# Altium project UCLA-DRS4.PrjPCB (part 1 of 10)
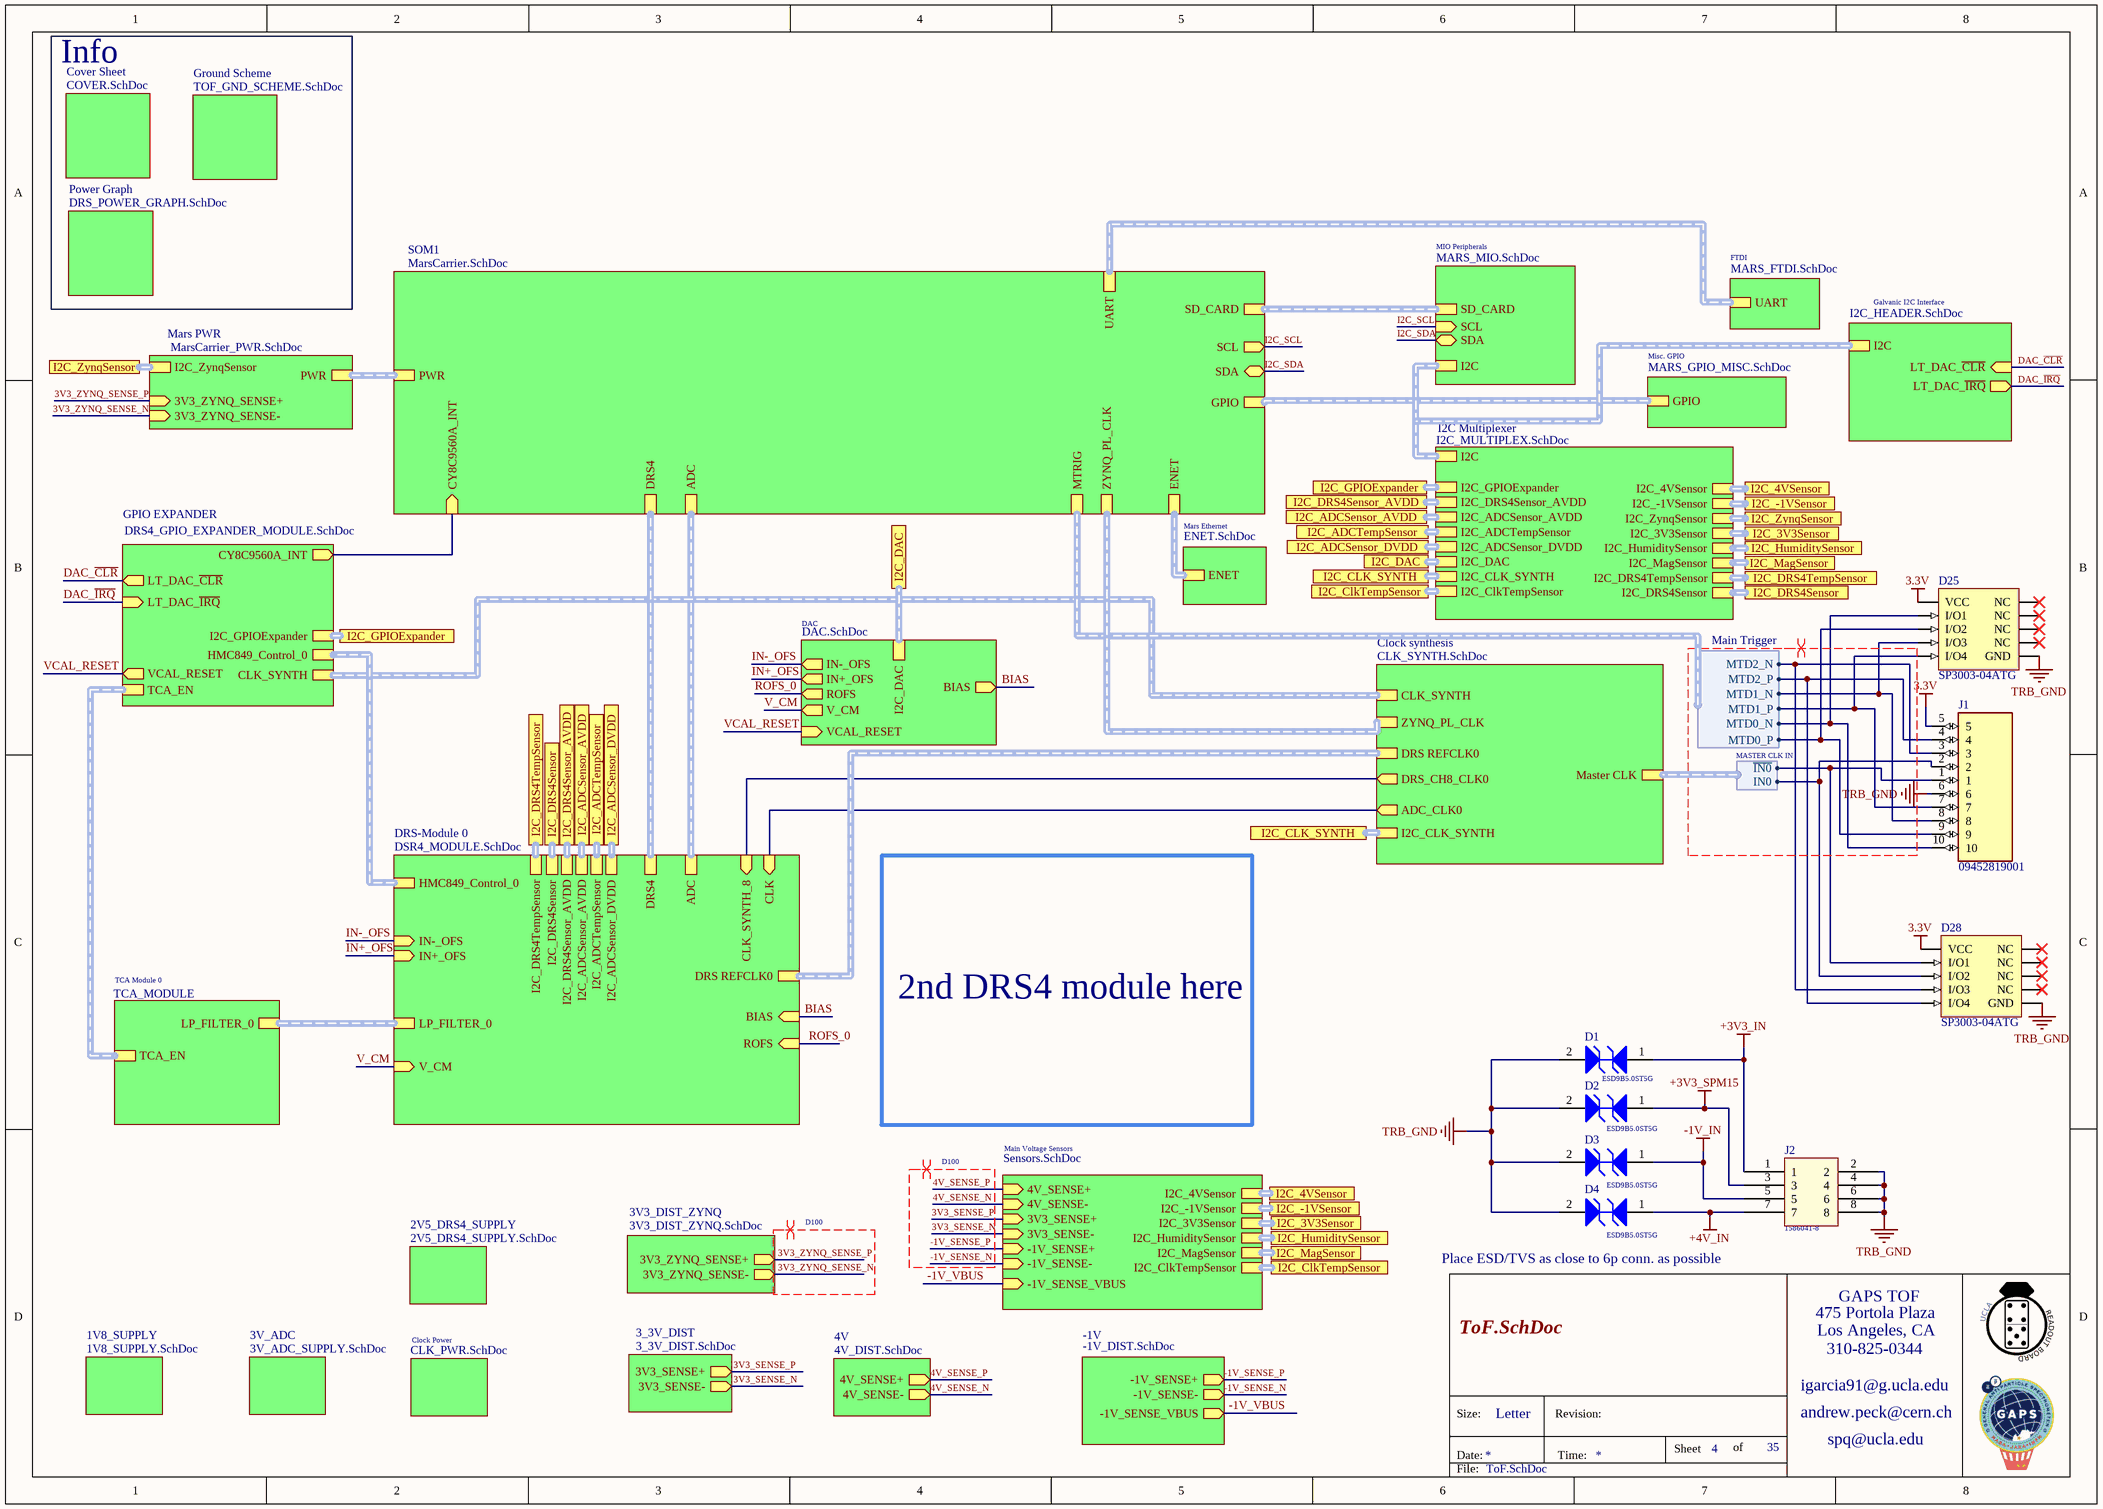
[diagram p0: ToF.SchDoc]
Revision: V2.3.9
35 sheets, 1264 parts. Net scope: hierarchical (ports join the sheet entries above them; power ports are global).
Board file: DRS4-PCB.PcbDoc
Sheets:
  ToF.SchDoc
    DRS-Module 0 = DSR4_MODULE.SchDoc
      DRS1 = DRS4.SchDoc
      FE0 = ANA_FE.SchDoc
      ADC = DRS4_ADC.SchDoc
      FE2 = ANA_FE.SchDoc
      FE4 = ANA_FE.SchDoc
      FE6 = ANA_FE.SchDoc
      FE1 = ANA_FE.SchDoc
      FE3 = ANA_FE.SchDoc
      FE5 = ANA_FE.SchDoc
      FE7 = ANA_FE.SchDoc
      FE8 = ANA_FE_CLK_SYNTH.SchDoc
    SOM1 = MarsCarrier.SchDoc
    Mars Ethernet = ENET.SchDoc
    DAC = DAC.SchDoc
    Clock synthesis = CLK_SYNTH.SchDoc
    TCA Module 0 = TCA_MODULE.SchDoc
      TCA CLK = TCA_CLK_DIST.SchDoc
      TCA FILTER = TCA_LP_FILTER.SchDoc
    MIO Peripherals = MARS_MIO.SchDoc
    Clock Power = CLK_PWR.SchDoc
    2V5_DRS4_SUPPLY = 2V5_DRS4_SUPPLY.SchDoc
    4V = 4V_DIST.SchDoc
    -1V = -1V_DIST.SchDoc
    3V_ADC = 3V_ADC_SUPPLY.SchDoc
    Mars PWR = MarsCarrier_PWR.SchDoc
      MarsZX2 PWR Reset = MARS_PORB.SchDoc
    3V3_DIST_ZYNQ = 3V3_DIST_ZYNQ.SchDoc
    3_3V_DIST = 3_3V_DIST.SchDoc
    Main Voltage Sensors = Sensors.SchDoc
    Misc. GPIO = MARS_GPIO_MISC.SchDoc
    FTDI = MARS_FTDI.SchDoc
    GPIO EXPANDER = DRS4_GPIO_EXPANDER_MODULE.SchDoc
      I2C GPIO = DRS4_GPIO_EXPANDER.SchDoc
      I2C GPIO LED = GPIO_EXPANDER_LED.SchDoc
    Galvanic I2C Interface = I2C_HEADER.SchDoc
    I2C Multiplexer = I2C_MULTIPLEX.SchDoc
    1V8_SUPPLY = 1V8_SUPPLY.SchDoc
    Cover Sheet = COVER.SchDoc
    Ground Scheme = TOF_GND_SCHEME.SchDoc
    Power Graph = DRS_POWER_GRAPH.SchDoc

## Sheet ToF.SchDoc: My title
size A3; Organization: University of California; Address1: 475 Portola Plaza; Address2: Los Angeles, CA 90095; DocumentNumber: 4; Revision: R01; SheetNumber: 4; SheetTotal: 35

### Parts
D1  ESD9B5.0ST5G  [ONSC-SOD-923-2-514AB-01_V]
D2  ESD9B5.0ST5G  [ONSC-SOD-923-2-514AB-01_V]
D3  ESD9B5.0ST5G  [ONSC-SOD-923-2-514AB-01_V]
D4  ESD9B5.0ST5G  [ONSC-SOD-923-2-514AB-01_V]
D25  Series: SP3003-04ATG  [Diode_SP3003-04ATG_LVDS_ESD]  (hidden comment: Diode_SP3003-04ATG_LVDS_ESD)
D28  Series: SP3003-04ATG  [Diode_SP3003-04ATG_LVDS_ESD]  (hidden comment: Diode_SP3003-04ATG_LVDS_ESD)
J1  09452819001  [09452812561]
J2  Series: 1586041-8  [Header_TE_Connectivity_1586041-8_8POS]  (hidden comment: Header_TE_Connectivity_1586041-8_8POS)

### Sub-sheets
1V8_SUPPLY = 1V8_SUPPLY.SchDoc: no entries
2V5_DRS4_SUPPLY = 2V5_DRS4_SUPPLY.SchDoc: no entries
3_3V_DIST = 3_3V_DIST.SchDoc: 3V3_SENSE- (out), 3V3_SENSE+ (out)
3V3_DIST_ZYNQ = 3V3_DIST_ZYNQ.SchDoc: 3V3_ZYNQ_SENSE- (out), 3V3_ZYNQ_SENSE+ (out)
3V_ADC = 3V_ADC_SUPPLY.SchDoc: no entries
4V = 4V_DIST.SchDoc: 4V_SENSE- (out), 4V_SENSE+ (out)
-1V = -1V_DIST.SchDoc: -1V_SENSE- (out), -1V_SENSE+ (out), -1V_SENSE_VBUS (out)
Clock Power = CLK_PWR.SchDoc: no entries
Clock synthesis = CLK_SYNTH.SchDoc: CLK_SYNTH (harness CLK SYNTH CONTROL), ZYNQ_PL_CLK (harness ZYNQ PL CLK), DRS REFCLK0 (harness DRS4 REFCLK0), DRS_CH8_CLK0 (out), Master CLK (harness MASTER CLK IN), ADC_CLK0 (out), I2C_CLK_SYNTH (harness Clock Synth I2C)
Cover Sheet = COVER.SchDoc: no entries
DAC = DAC.SchDoc: I2C_DAC (harness DAC  I2C), IN-_OFS (out), IN+_OFS (out), ROFS (out), V_CM (out), VCAL_RESET (in), BIAS (out)
DRS-Module 0 = DSR4_MODULE.SchDoc: ADC (harness ADC), DRS4 (harness DRS4), DRS REFCLK0 (harness DRS4 REFCLK0), BIAS (in), ROFS (in), HMC849_Control_0 (harness HMC849 Control 0), LP_FILTER_0 (harness TCA Filter 0), V_CM (in), CLK_SYNTH_8 (in), IN-_OFS (in), IN+_OFS (in), CLK (in), I2C_DRS4TempSensor (harness DRS4 Temp Sensor I2C), I2C_DRS4Sensor (harness DRS4 Current Sensor I2C), I2C_DRS4Sensor_AVDD (harness DRS4 AVDD Current Sensor I2C), I2C_ADCSensor_AVDD (harness ADC AVDD Current Sensor I2C), I2C_ADCTempSensor (harness ADC Temp Sensor I2C), I2C_ADCSensor_DVDD (harness ADC DVDD Current Sensor I2C)
FTDI = MARS_FTDI.SchDoc: UART (harness Mars UART)
Galvanic I2C Interface = I2C_HEADER.SchDoc: I2C (harness Mars I2C), LT_DAC_~{CLR} (in), LT_DAC_~{IRQ} (out)
GPIO EXPANDER = DRS4_GPIO_EXPANDER_MODULE.SchDoc: HMC849_Control_0 (harness HMC849 Control 0), CLK_SYNTH (harness CLK SYNTH CONTROL), TCA_EN (harness TCA EN), VCAL_RESET (out), LT_DAC_~{CLR} (out), LT_DAC_~{IRQ} (in), CY8C9560A_INT (out), I2C_GPIOExpander (harness GPIO Expander I2C)
Ground Scheme = TOF_GND_SCHEME.SchDoc: no entries
I2C Multiplexer = I2C_MULTIPLEX.SchDoc: I2C (harness Mars I2C), I2C_4VSensor (harness 4V Current Sensor I2C), I2C_-1VSensor (harness -1V Current Sensor I2C), I2C_ZynqSensor (harness 3V3 Zynq Current Sensor I2C), I2C_3V3Sensor (harness 3V3 Current Sensor I2C), I2C_HumiditySensor (harness Humidity Sensor I2C), I2C_MagSensor (harness Magnetic Field Sensor I2C), I2C_DRS4TempSensor (harness DRS4 Temp Sensor I2C), I2C_DRS4Sensor (harness DRS4 Current Sensor I2C), I2C_GPIOExpander (harness GPIO Expander I2C), I2C_DRS4Sensor_AVDD (harness DRS4 AVDD Current Sensor I2C), I2C_ADCSensor_AVDD (harness ADC AVDD Current Sensor I2C), I2C_ADCTempSensor (harness ADC Temp Sensor I2C), I2C_ADCSensor_DVDD (harness ADC DVDD Current Sensor I2C), I2C_DAC (harness DAC  I2C), I2C_CLK_SYNTH (harness Clock Synth I2C), I2C_ClkTempSensor (harness Clk Synth Temp Sensor I2C)
Main Voltage Sensors = Sensors.SchDoc: -1V_SENSE- (in), -1V_SENSE+ (in), 4V_SENSE- (in), 4V_SENSE+ (in), 3V3_SENSE- (in), 3V3_SENSE+ (in), I2C_4VSensor (harness 4V Current Sensor I2C), I2C_-1VSensor (harness -1V Current Sensor I2C), I2C_3V3Sensor (harness 3V3 Current Sensor I2C), I2C_HumiditySensor (harness Humidity Sensor I2C), I2C_MagSensor (harness Magnetic Field Sensor I2C), I2C_ClkTempSensor (harness Clk Synth Temp Sensor I2C), -1V_SENSE_VBUS (in)
Mars Ethernet = ENET.SchDoc: ENET (harness Mars ENET)
Mars PWR = MarsCarrier_PWR.SchDoc: PWR (harness Mars Power), 3V3_ZYNQ_SENSE- (in), 3V3_ZYNQ_SENSE+ (in), I2C_ZynqSensor (harness 3V3 Zynq Current Sensor I2C)
MIO Peripherals = MARS_MIO.SchDoc: SD_CARD (harness Mars SD Card), SCL (in), SDA (bidir), I2C (harness Mars I2C)
Misc. GPIO = MARS_GPIO_MISC.SchDoc: GPIO (harness Misc I/O)
Power Graph = DRS_POWER_GRAPH.SchDoc: no entries
SOM1 = MarsCarrier.SchDoc: ADC (harness ADC), DRS4 (harness DRS4), ZYNQ_PL_CLK (harness ZYNQ PL CLK), ENET (harness Mars ENET), SD_CARD (harness Mars SD Card), SCL (out), SDA (bidir), PWR (harness Mars Power), GPIO (harness Misc I/O), UART (harness Mars UART), CY8C9560A_INT (in), MTRIG (harness Main Trigger)
TCA Module 0 = TCA_MODULE: LP_FILTER_0 (harness TCA Filter 0), TCA_EN (harness TCA EN)

### Ports
I2C_3V3Sensor (harness 3V3 Current Sensor I2C), I2C_4VSensor (harness 4V Current Sensor I2C), I2C_-1VSensor (harness -1V Current Sensor I2C), I2C_ADCSensor_AVDD (harness ADC AVDD Current Sensor I2C), I2C_ADCSensor_DVDD (harness ADC DVDD Current Sensor I2C), I2C_ADCTempSensor (harness ADC Temp Sensor I2C), I2C_CLK_SYNTH (harness Clock Synth I2C), I2C_ClkTempSensor (harness Clk Synth Temp Sensor I2C), I2C_DAC (harness DAC  I2C), I2C_DRS4Sensor (harness DRS4 Current Sensor I2C), I2C_DRS4Sensor_AVDD (harness DRS4 AVDD Current Sensor I2C), I2C_DRS4TempSensor (harness DRS4 Temp Sensor I2C), I2C_GPIOExpander (harness GPIO Expander I2C), I2C_HumiditySensor (harness Humidity Sensor I2C), I2C_MagSensor (harness Magnetic Field Sensor I2C), I2C_ZynqSensor (harness 3V3 Zynq Current Sensor I2C)

### Harnesses
MASTER CLK IN: IN0, ~{IN0}
Main Trigger: MTD0_P, MTD0_N, MTD1_P, MTD1_N, MTD2_P, MTD2_N

### Nets
3.3V: D25.3(VCC) D28.3(VCC) J1.5
+3V3_IN: D1.1(A1) J2.1
+3V3_SPM15: D2.1(A1) J2.3
+4V_IN: D4.1(A1) J2.7
-1V_IN: D3.1(A1) J2.5
-1V_VBUS: sheet -1V/-1V_SENSE_VBUS, sheet Main Voltage Sensors/-1V_SENSE_VBUS
TRB_GND: D1.2(A2) D2.2(A2) D3.2(A2) D4.2(A2) D25.8(GND) D28.8(GND) J1.6 J2.2 J2.4 J2.6 J2.8
3V3_SENSE_N: sheet 3_3V_DIST/3V3_SENSE-, sheet Main Voltage Sensors/3V3_SENSE-
3V3_SENSE_P: sheet 3_3V_DIST/3V3_SENSE+, sheet Main Voltage Sensors/3V3_SENSE+
3V3_ZYNQ_SENSE_N: sheet Mars PWR/3V3_ZYNQ_SENSE-, sheet 3V3_DIST_ZYNQ/3V3_ZYNQ_SENSE-
3V3_ZYNQ_SENSE_P: sheet Mars PWR/3V3_ZYNQ_SENSE+, sheet 3V3_DIST_ZYNQ/3V3_ZYNQ_SENSE+
4V_SENSE_N: sheet 4V/4V_SENSE-, sheet Main Voltage Sensors/4V_SENSE-
4V_SENSE_P: sheet 4V/4V_SENSE+, sheet Main Voltage Sensors/4V_SENSE+
-1V_SENSE_N: sheet -1V/-1V_SENSE-, sheet Main Voltage Sensors/-1V_SENSE-
-1V_SENSE_P: sheet -1V/-1V_SENSE+, sheet Main Voltage Sensors/-1V_SENSE+
ADC_CLK: sheet DRS-Module 0/CLK, sheet Clock synthesis/ADC_CLK0
BIAS: sheet DRS-Module 0/BIAS, sheet DAC/BIAS
CLK_SYNTH_8: sheet DRS-Module 0/CLK_SYNTH_8, sheet Clock synthesis/DRS_CH8_CLK0
DAC_~{CLR}: sheet GPIO EXPANDER/LT_DAC_~{CLR}, sheet Galvanic I2C Interface/LT_DAC_~{CLR}
DAC_~{IRQ}: sheet GPIO EXPANDER/LT_DAC_~{IRQ}, sheet Galvanic I2C Interface/LT_DAC_~{IRQ}
I2C_SCL: sheet SOM1/SCL, sheet MIO Peripherals/SCL
I2C_SDA: sheet SOM1/SDA, sheet MIO Peripherals/SDA
IN+_OFS: sheet DRS-Module 0/IN+_OFS, sheet DAC/IN+_OFS
IN-_OFS: sheet DRS-Module 0/IN-_OFS, sheet DAC/IN-_OFS  [project net ~{IN}~{_OFS}]
IO_B35_L3_N: D25.1(I/O1) J1.10 ; sheet SOM1/MTRIG.MTD0_N
IO_B35_L3_P: D25.2(I/O2) J1.9 ; sheet SOM1/MTRIG.MTD0_P
IO_B35_L5_N: D25.4(I/O3) J1.8 ; sheet SOM1/MTRIG.MTD1_N
IO_B35_L5_P: D25.5(I/O4) J1.7 ; sheet SOM1/MTRIG.MTD1_P
IO_B35_L6_N: D28.4(I/O3) J1.3 ; sheet SOM1/MTRIG.MTD2_N
IO_B35_L6_P: D28.5(I/O4) J1.4 ; sheet SOM1/MTRIG.MTD2_P
IO_B35_L15_AD12_F20_N: sheet SOM1/CY8C9560A_INT, sheet GPIO EXPANDER/CY8C9560A_INT
MCLK_N: D28.1(I/O1) J1.1 ; sheet Clock synthesis/Master CLK.~{IN0}
MCLK_P: D28.2(I/O2) J1.2 ; sheet Clock synthesis/Master CLK.IN0
ROFS_0: sheet DRS-Module 0/ROFS, sheet DAC/ROFS  [project net R-OFS]
V_CM: sheet DRS-Module 0/V_CM, sheet DAC/V_CM
VCAL_RESET: sheet DAC/VCAL_RESET, sheet GPIO EXPANDER/VCAL_RESET

Not connected (* = marked no-connect by the designer): D25 6(NC)* 7(NC)* 9(NC)* 10(NC)*; D28 6(NC)* 7(NC)* 9(NC)* 10(NC)*

### Buses and harness runs
harness port I2C_3V3Sensor = sheet I2C Multiplexer/I2C_3V3Sensor
harness port I2C_3V3Sensor = sheet Main Voltage Sensors/I2C_3V3Sensor
harness port I2C_4VSensor = sheet I2C Multiplexer/I2C_4VSensor
harness port I2C_4VSensor = sheet Main Voltage Sensors/I2C_4VSensor
harness port I2C_-1VSensor = sheet I2C Multiplexer/I2C_-1VSensor
harness port I2C_-1VSensor = sheet Main Voltage Sensors/I2C_-1VSensor
harness port I2C_ADCSensor_AVDD = sheet DRS-Module 0/I2C_ADCSensor_AVDD
harness port I2C_ADCSensor_AVDD = sheet I2C Multiplexer/I2C_ADCSensor_AVDD
harness port I2C_ADCSensor_DVDD = sheet DRS-Module 0/I2C_ADCSensor_DVDD
harness port I2C_ADCSensor_DVDD = sheet I2C Multiplexer/I2C_ADCSensor_DVDD
harness port I2C_ADCTempSensor = sheet DRS-Module 0/I2C_ADCTempSensor
harness port I2C_ADCTempSensor = sheet I2C Multiplexer/I2C_ADCTempSensor
harness port I2C_CLK_SYNTH = sheet Clock synthesis/I2C_CLK_SYNTH
harness port I2C_CLK_SYNTH = sheet I2C Multiplexer/I2C_CLK_SYNTH
harness port I2C_ClkTempSensor = sheet I2C Multiplexer/I2C_ClkTempSensor
harness port I2C_ClkTempSensor = sheet Main Voltage Sensors/I2C_ClkTempSensor
harness port I2C_DAC = sheet DAC/I2C_DAC
harness port I2C_DAC = sheet I2C Multiplexer/I2C_DAC
harness port I2C_DRS4Sensor = sheet DRS-Module 0/I2C_DRS4Sensor
harness port I2C_DRS4Sensor = sheet I2C Multiplexer/I2C_DRS4Sensor
harness port I2C_DRS4Sensor_AVDD = sheet DRS-Module 0/I2C_DRS4Sensor_AVDD
harness port I2C_DRS4Sensor_AVDD = sheet I2C Multiplexer/I2C_DRS4Sensor_AVDD
harness port I2C_DRS4TempSensor = sheet DRS-Module 0/I2C_DRS4TempSensor
harness port I2C_DRS4TempSensor = sheet I2C Multiplexer/I2C_DRS4TempSensor
harness port I2C_GPIOExpander = sheet GPIO EXPANDER/I2C_GPIOExpander
harness port I2C_GPIOExpander = sheet I2C Multiplexer/I2C_GPIOExpander
harness port I2C_HumiditySensor = sheet I2C Multiplexer/I2C_HumiditySensor
harness port I2C_HumiditySensor = sheet Main Voltage Sensors/I2C_HumiditySensor
harness port I2C_MagSensor = sheet I2C Multiplexer/I2C_MagSensor
harness port I2C_MagSensor = sheet Main Voltage Sensors/I2C_MagSensor
harness port I2C_ZynqSensor = sheet I2C Multiplexer/I2C_ZynqSensor
harness port I2C_ZynqSensor = sheet Mars PWR/I2C_ZynqSensor
harness sheet Clock synthesis/CLK_SYNTH = sheet GPIO EXPANDER/CLK_SYNTH
harness sheet Clock synthesis/DRS REFCLK0 = sheet DRS-Module 0/DRS REFCLK0
harness sheet Clock synthesis/ZYNQ_PL_CLK = sheet SOM1/ZYNQ_PL_CLK
harness sheet DRS-Module 0/ADC = sheet SOM1/ADC
harness sheet DRS-Module 0/DRS4 = sheet SOM1/DRS4
harness sheet DRS-Module 0/HMC849_Control_0 = sheet GPIO EXPANDER/HMC849_Control_0
harness sheet DRS-Module 0/LP_FILTER_0 = sheet TCA Module 0/LP_FILTER_0
harness sheet FTDI/UART = sheet SOM1/UART
harness sheet Galvanic I2C Interface/I2C = sheet I2C Multiplexer/I2C = sheet MIO Peripherals/I2C
harness sheet GPIO EXPANDER/TCA_EN = sheet TCA Module 0/TCA_EN
harness sheet Mars Ethernet/ENET = sheet SOM1/ENET
harness sheet Mars PWR/PWR = sheet SOM1/PWR
harness sheet MIO Peripherals/SD_CARD = sheet SOM1/SD_CARD
harness sheet Misc. GPIO/GPIO = sheet SOM1/GPIO

### Layout directives
differential pair; differential pair class D100: 3V3_SENSE_N, 3V3_SENSE_P, 3V3_ZYNQ_SENSE_N, 3V3_ZYNQ_SENSE_P, 4V_SENSE_N, 4V_SENSE_P, -1V_SENSE_N, -1V_SENSE_P
differential pair; differential pair class D100; rule Differential Pairs Routing [Pref Gap = 10mil    Min Gap  = 5mil    Max Gap  = 10milPref Width = 15mil    Min Width  = 3.244mil    Max Width  = 15mil]; rule Matched Net Lengths [Tolerance = 100mil]: (no net found under the mark)

### Notes on the sheet
- Info
- 2nd DRS4 module here
- Place ESD/TVS as close to 6p conn. as possible
- 475 Portola Plaza
- GAPS TOF
- igarcia91@g.ucla.edu
- Los Angeles, CA
- 310-825-0344
- Size:
- Date:
- Letter
- Revision:
- Time:
- Sheet
- of
- andrew.peck@cern.ch
- spq@ucla.edu
- File:

### Library data of the parts
D1-D4 = ESD9B5.0ST5G: Transient Voltage Suppressor, Micro-Packaged Diode for ESD Protection, 2-Pin SOD-923, Pb-Free, Tape and Reel; Manufacturer: On Semiconductor; Direction: Bidirectional; VRWM Max (V): 5; V(BR) Min (V): 5.8; IR Max (uA): 1; ComponentLink1Description: Manufacturer URL; ComponentLink2Description: Datasheet; PartNumber: ESD9B5.0ST5G; ComponentLink3Description: Package Specification; PackageDescription: 2-Pin SOD, Body 0.8 x 0.6 mm; ComponentLink3URL: http://www.onsemi.com/pub_link/Collateral/514AB.PDF; DatasheetVersion: Rev. 2; ComponentLink1URL: http://www.onsemi.com/; PackageReference: SOD-923-2-514AB-01; Packing: Tape and Reel; PackageVersion: Rev. C, 03/2011; Mounting Technology: Surface Mount; Number of Lines: 1; ComponentLink2URL: http://www.onsemi.cn/pub_link/Collateral/ESD9B-D.PDF; RoHS: Pb-Free; Supplier 1: Mouser; Supplier Part Number 1: 863-ESD9B5.0ST5G
D25 D28 = Diode_SP3003-04ATG_LVDS_ESD: ESD Suppressors / TVS Diodes 4 Ch 8kV 0.65pF SPA; Supplier 1: Mouser; Supplier Part Number 1: 576-SP3003-04ATG
J1 = 09452819001: Connector; Manufacturer_Name: HARTING; Datasheet Link: https://b2b.harting.com/files/download/PRD/PDF_TS/09452819001_100805966DRW000C.pdf?siteName=Ebusiness+Site&autoLogoutEnabled=true&autoLogoutTime=1800&showPrivacyEmailAgreement=false&contextURL=https%3A%2F%2Fb2b.harting.com%2Febusiness%2Fen_us; Manufacturer_Part_Number: 09452819001; Mouser Part Number: 617-09452819001; Mouser Price/Stock: https://www.mouser.co.uk/ProductDetail/HARTING/09452819001?qs=T3oQrply3y%2Fl7UBgasft0g%3D%3D; Arrow Part Number: 09452819001; Arrow Price/Stock: https://www.arrow.com/en/products/09452819001/harting
J2 = Header_TE_Connectivity_1586041-8_8POS: Headers & Wire Housings RA HDR W/O PEGS 8P; Supplier Part Number 1: 571-15860418; Supplier 1: Mouser

## Sheet DSR4_MODULE.SchDoc: My title
size A3; Organization: University of California; Address1: 475 Portola Plaza; Address2: Los Angeles, CA 90095; DocumentNumber: 17; Revision: R01; SheetNumber: 17; SheetTotal: 35
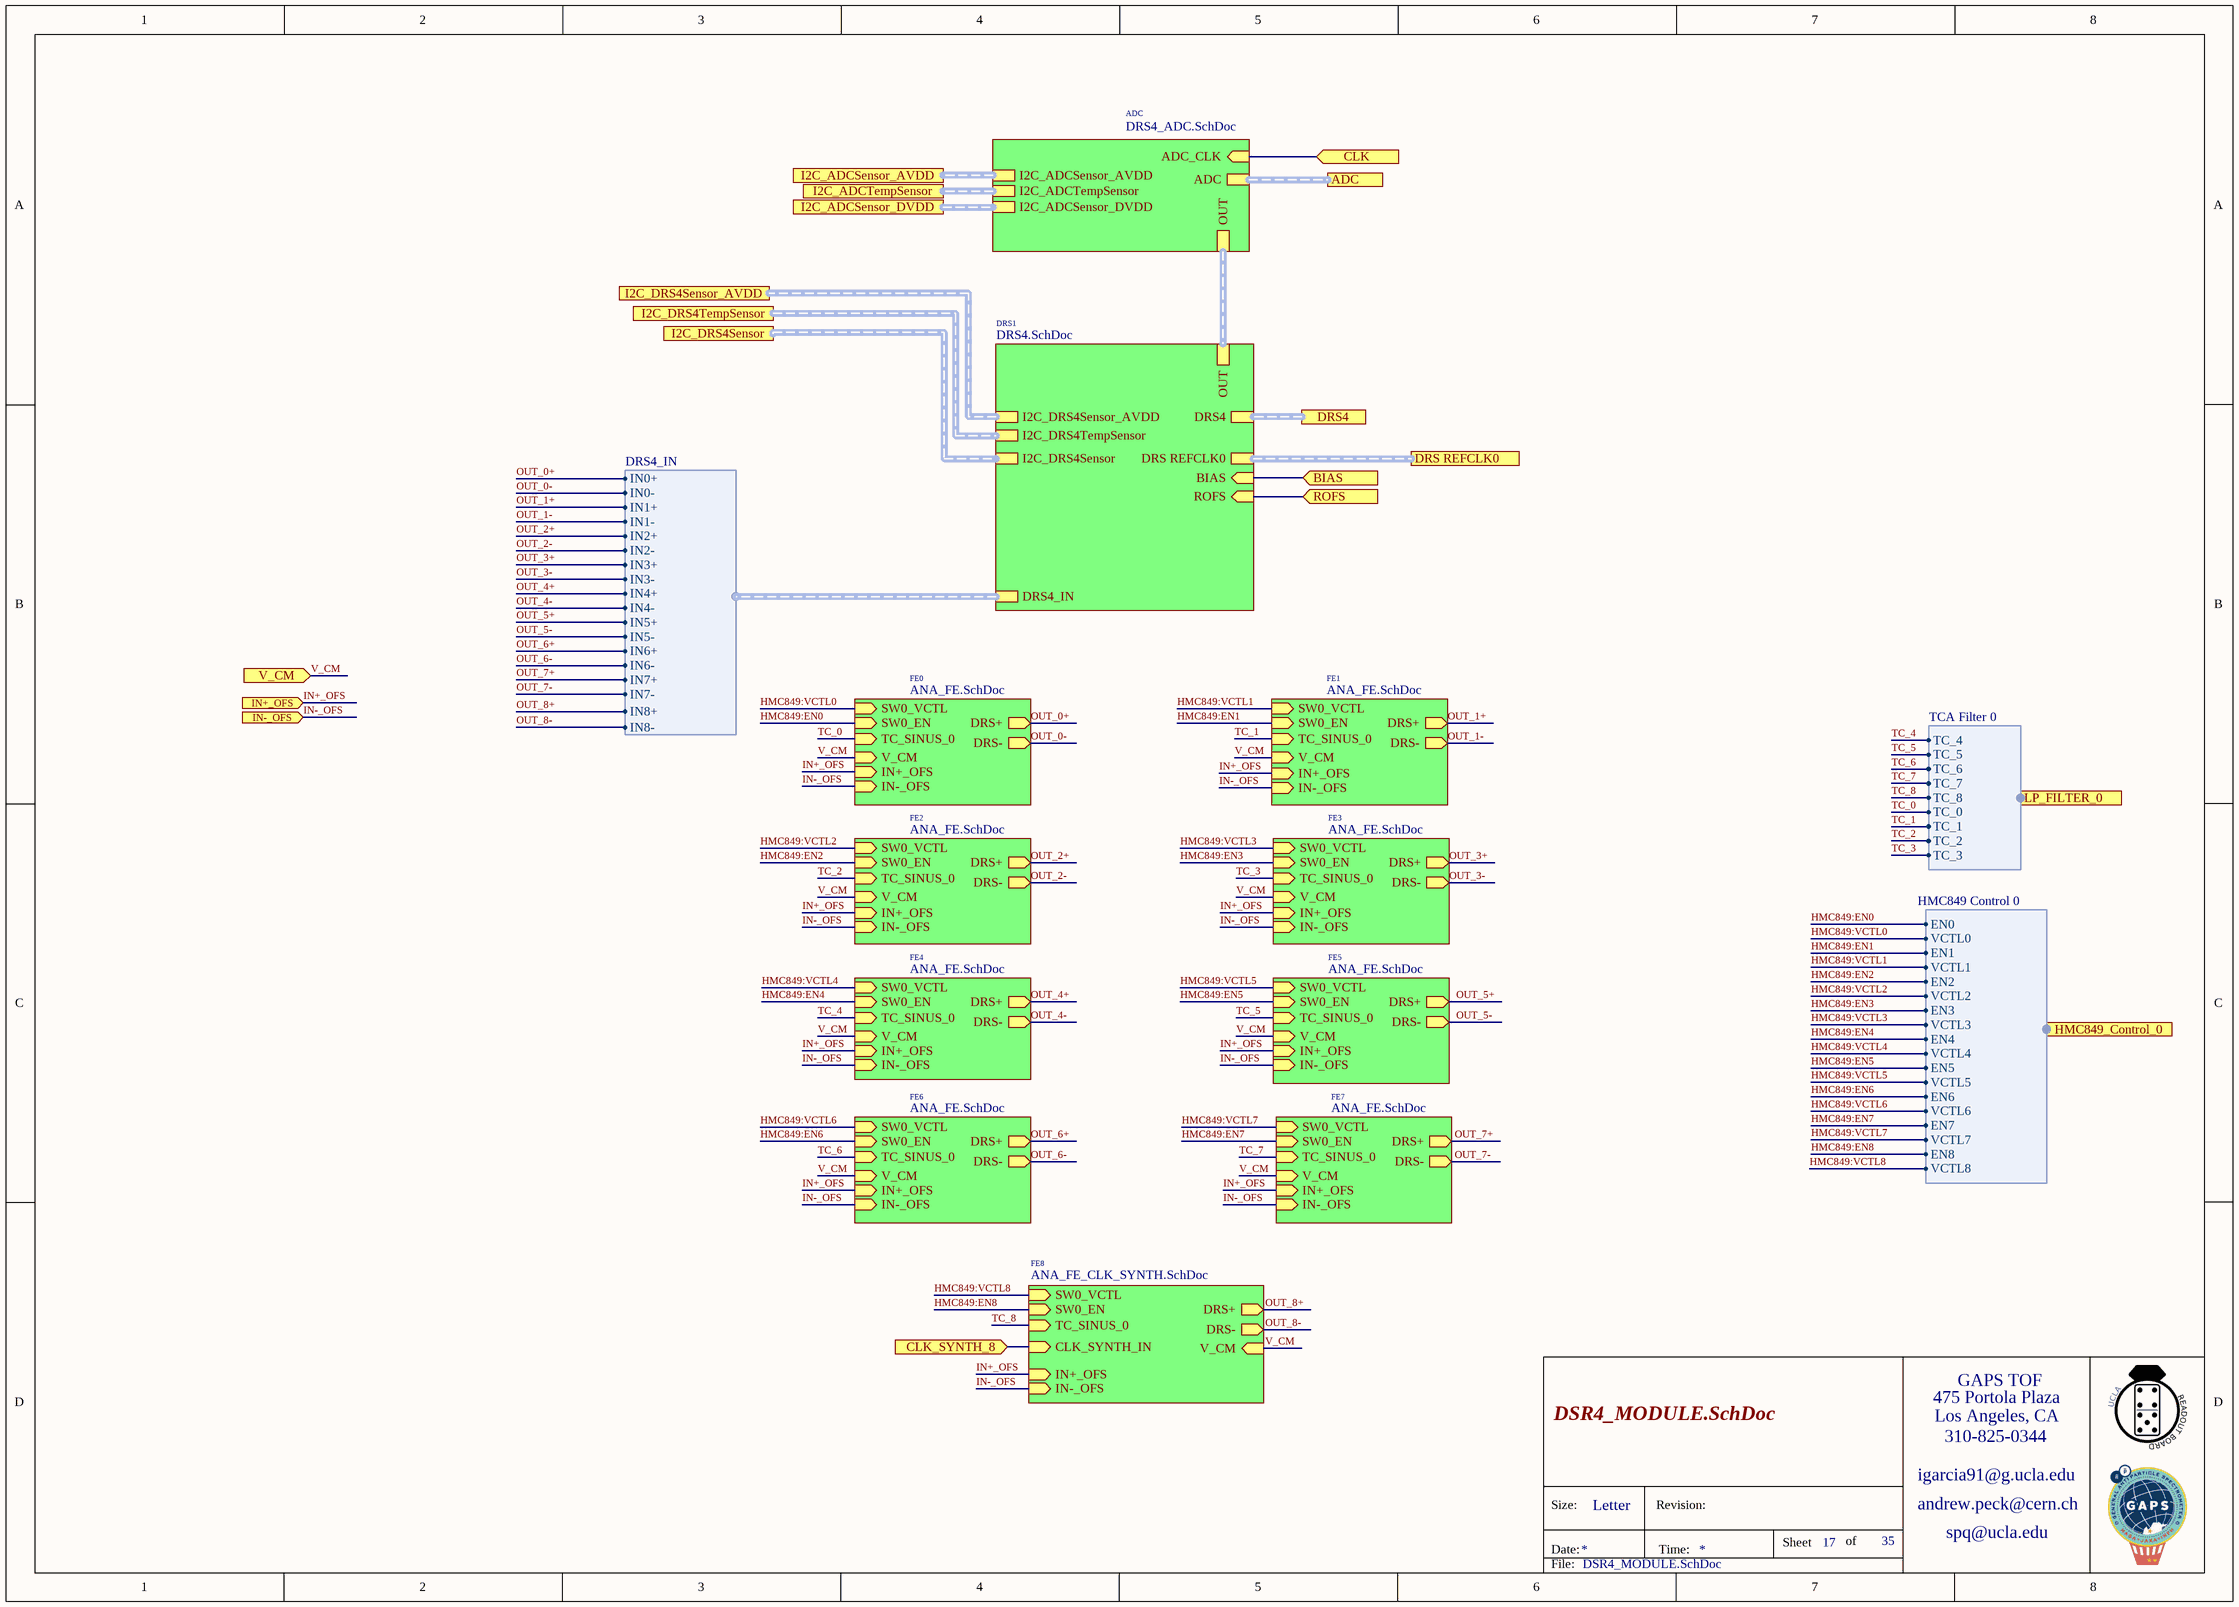
[diagram p1: DSR4_MODULE.SchDoc]

### Sub-sheets
ADC = DRS4_ADC.SchDoc: ADC (harness ADC), OUT (harness DRS4_OUT), ADC_CLK (in), I2C_ADCSensor_AVDD (harness ADC AVDD Current Sensor I2C), I2C_ADCTempSensor (harness ADC Temp Sensor I2C), I2C_ADCSensor_DVDD (harness ADC DVDD Current Sensor I2C)
DRS1 = DRS4.SchDoc: DRS4_IN (harness DRS4_IN), DRS4 (harness DRS4), OUT (harness DRS4_OUT), DRS REFCLK0 (harness DRS4 REFCLK0), BIAS (in), ROFS (in), I2C_DRS4TempSensor (harness DRS4 Temp Sensor I2C), I2C_DRS4Sensor (harness DRS4 Current Sensor I2C), I2C_DRS4Sensor_AVDD (harness DRS4 AVDD Current Sensor I2C)
FE0 = ANA_FE.SchDoc: DRS+ (out), DRS- (out), V_CM (in), SW0_VCTL (in), SW0_EN (in), TC_SINUS_0 (in), IN+_OFS (in), IN-_OFS (in)
FE1 = ANA_FE.SchDoc: DRS+ (out), DRS- (out), V_CM (in), SW0_VCTL (in), SW0_EN (in), TC_SINUS_0 (in), IN+_OFS (in), IN-_OFS (in)
FE2 = ANA_FE.SchDoc: DRS+ (out), DRS- (out), V_CM (in), SW0_VCTL (in), SW0_EN (in), TC_SINUS_0 (in), IN+_OFS (in), IN-_OFS (in)
FE3 = ANA_FE.SchDoc: DRS+ (out), DRS- (out), V_CM (in), SW0_VCTL (in), SW0_EN (in), TC_SINUS_0 (in), IN+_OFS (in), IN-_OFS (in)
FE4 = ANA_FE.SchDoc: DRS+ (out), DRS- (out), V_CM (in), SW0_VCTL (in), SW0_EN (in), TC_SINUS_0 (in), IN+_OFS (in), IN-_OFS (in)
FE5 = ANA_FE.SchDoc: DRS+ (out), DRS- (out), V_CM (in), SW0_VCTL (in), SW0_EN (in), TC_SINUS_0 (in), IN+_OFS (in), IN-_OFS (in)
FE6 = ANA_FE.SchDoc: DRS+ (out), DRS- (out), V_CM (in), SW0_VCTL (in), SW0_EN (in), TC_SINUS_0 (in), IN+_OFS (in), IN-_OFS (in)
FE7 = ANA_FE.SchDoc: DRS+ (out), DRS- (out), V_CM (in), SW0_VCTL (in), SW0_EN (in), TC_SINUS_0 (in), IN+_OFS (in), IN-_OFS (in)
FE8 = ANA_FE_CLK_SYNTH.SchDoc: DRS+ (out), DRS- (out), V_CM (in), SW0_VCTL (in), SW0_EN (in), TC_SINUS_0 (in), CLK_SYNTH_IN (in), IN+_OFS (in), IN-_OFS (in)

### Ports
ADC (harness ADC), BIAS (in), CLK (in), CLK_SYNTH_8 (in), DRS4 (harness DRS4), DRS REFCLK0 (harness DRS4 REFCLK0), HMC849_Control_0 (harness HMC849 Control 0), I2C_ADCSensor_AVDD (harness ADC AVDD Current Sensor I2C), I2C_ADCSensor_DVDD (harness ADC DVDD Current Sensor I2C), I2C_ADCTempSensor (harness ADC Temp Sensor I2C), I2C_DRS4Sensor (harness DRS4 Current Sensor I2C), I2C_DRS4Sensor_AVDD (harness DRS4 AVDD Current Sensor I2C), I2C_DRS4TempSensor (harness DRS4 Temp Sensor I2C), IN+_OFS (in), IN-_OFS (in), LP_FILTER_0 (harness TCA Filter 0), ROFS (in), V_CM (in)

### Harnesses
DRS4_IN: IN0+, IN0-, IN1+, IN1-, IN2+, IN2-, IN3+, IN3-, IN4+, IN4-, IN5+, IN5-, IN6+, IN6-, IN7+, IN7-, IN8+, IN8-
TCA Filter 0: TC_4, TC_5, TC_6, TC_7, TC_8, TC_0, TC_1, TC_2, TC_3
HMC849 Control 0: EN0, VCTL0, EN1, VCTL1, EN2, VCTL2, EN3, VCTL3, EN4, VCTL4, EN5, VCTL5, EN6, VCTL6, EN7, VCTL7, EN8, VCTL8

### Nets
ADC_CLK: port CLK, sheet ADC/ADC_CLK
BIAS: port BIAS, sheet DRS1/BIAS
CLK_SYNTH_8: port CLK_SYNTH_8, sheet FE8/CLK_SYNTH_IN
HMC849:EN0: sheet FE0/SW0_EN, port HMC849_Control_0.EN0
HMC849:EN1: sheet FE1/SW0_EN, port HMC849_Control_0.EN1
HMC849:EN2: sheet FE2/SW0_EN, port HMC849_Control_0.EN2
HMC849:EN3: sheet FE3/SW0_EN, port HMC849_Control_0.EN3
HMC849:EN4: sheet FE4/SW0_EN, port HMC849_Control_0.EN4
HMC849:EN5: sheet FE5/SW0_EN, port HMC849_Control_0.EN5
HMC849:EN6: sheet FE6/SW0_EN, port HMC849_Control_0.EN6
HMC849:EN7: sheet FE7/SW0_EN, port HMC849_Control_0.EN7
HMC849:EN8: sheet FE8/SW0_EN, port HMC849_Control_0.EN8
HMC849:VCTL0: sheet FE0/SW0_VCTL, port HMC849_Control_0.VCTL0
HMC849:VCTL1: sheet FE1/SW0_VCTL, port HMC849_Control_0.VCTL1
HMC849:VCTL2: sheet FE2/SW0_VCTL, port HMC849_Control_0.VCTL2
HMC849:VCTL3: sheet FE3/SW0_VCTL, port HMC849_Control_0.VCTL3
HMC849:VCTL4: sheet FE4/SW0_VCTL, port HMC849_Control_0.VCTL4
HMC849:VCTL5: sheet FE5/SW0_VCTL, port HMC849_Control_0.VCTL5
HMC849:VCTL6: sheet FE6/SW0_VCTL, port HMC849_Control_0.VCTL6
HMC849:VCTL7: sheet FE7/SW0_VCTL, port HMC849_Control_0.VCTL7
HMC849:VCTL8: sheet FE8/SW0_VCTL, port HMC849_Control_0.VCTL8
IN+_OFS: port IN+_OFS, sheet FE0/IN+_OFS, sheet FE2/IN+_OFS, sheet FE4/IN+_OFS, sheet FE6/IN+_OFS, sheet FE1/IN+_OFS, sheet FE3/IN+_OFS, sheet FE5/IN+_OFS, sheet FE7/IN+_OFS, sheet FE8/IN+_OFS
IN-_OFS: port IN-_OFS, sheet FE0/IN-_OFS, sheet FE2/IN-_OFS, sheet FE4/IN-_OFS, sheet FE6/IN-_OFS, sheet FE1/IN-_OFS, sheet FE3/IN-_OFS, sheet FE5/IN-_OFS, sheet FE7/IN-_OFS, sheet FE8/IN-_OFS  [project net ~{IN}~{_OFS}]
OUT_0+: sheet FE0/DRS+, sheet DRS1/DRS4_IN.IN0+  [project net DRS4_IN0_P]
OUT_0-: sheet FE0/DRS-, sheet DRS1/DRS4_IN.IN0-  [project net DRS4_IN0_N]
OUT_1+: sheet FE1/DRS+, sheet DRS1/DRS4_IN.IN1+  [project net DRS4_IN1_P]
OUT_1-: sheet FE1/DRS-, sheet DRS1/DRS4_IN.IN1-  [project net DRS4_IN1_N]
OUT_2+: sheet FE2/DRS+, sheet DRS1/DRS4_IN.IN2+  [project net DRS4_IN2_P]
OUT_2-: sheet FE2/DRS-, sheet DRS1/DRS4_IN.IN2-  [project net DRS4_IN2_N]
OUT_3+: sheet FE3/DRS+, sheet DRS1/DRS4_IN.IN3+  [project net DRS4_IN3_P]
OUT_3-: sheet FE3/DRS-, sheet DRS1/DRS4_IN.IN3-  [project net DRS4_IN3_N]
OUT_4+: sheet FE4/DRS+, sheet DRS1/DRS4_IN.IN4+  [project net DRS4_IN4_P]
OUT_4-: sheet FE4/DRS-, sheet DRS1/DRS4_IN.IN4-  [project net DRS4_IN4_N]
OUT_5+: sheet FE5/DRS+, sheet DRS1/DRS4_IN.IN5+  [project net DRS4_IN5_P]
OUT_5-: sheet FE5/DRS-, sheet DRS1/DRS4_IN.IN5-  [project net DRS4_IN5_N]
OUT_6+: sheet FE6/DRS+, sheet DRS1/DRS4_IN.IN6+  [project net DRS4_IN6_P]
OUT_6-: sheet FE6/DRS-, sheet DRS1/DRS4_IN.IN6-  [project net DRS4_IN6_N]
OUT_7+: sheet FE7/DRS+, sheet DRS1/DRS4_IN.IN7+  [project net DRS4_IN7_P]
OUT_7-: sheet FE7/DRS-, sheet DRS1/DRS4_IN.IN7-  [project net DRS4_IN7_N]
OUT_8+: sheet FE8/DRS+, sheet DRS1/DRS4_IN.IN8+  [project net DRS4_IN8_P]
OUT_8-: sheet FE8/DRS-, sheet DRS1/DRS4_IN.IN8-  [project net DRS4_IN8_N]
R-OFS: port ROFS, sheet DRS1/ROFS
TC_0: sheet FE0/TC_SINUS_0, port LP_FILTER_0.TC_0
TC_1: sheet FE1/TC_SINUS_0, port LP_FILTER_0.TC_1
TC_2: sheet FE2/TC_SINUS_0, port LP_FILTER_0.TC_2
TC_3: sheet FE3/TC_SINUS_0, port LP_FILTER_0.TC_3
TC_4: sheet FE4/TC_SINUS_0, port LP_FILTER_0.TC_4
TC_5: sheet FE5/TC_SINUS_0, port LP_FILTER_0.TC_5
TC_6: sheet FE6/TC_SINUS_0, port LP_FILTER_0.TC_6
TC_7: sheet FE7/TC_SINUS_0, port LP_FILTER_0.TC_7
TC_8: sheet FE8/TC_SINUS_0, port LP_FILTER_0.TC_8
V_CM: port V_CM, sheet FE0/V_CM, sheet FE2/V_CM, sheet FE4/V_CM, sheet FE6/V_CM, sheet FE1/V_CM, sheet FE3/V_CM, sheet FE5/V_CM, sheet FE7/V_CM, sheet FE8/V_CM

### Buses and harness runs
harness port ADC = sheet ADC/ADC
harness port DRS4 = sheet DRS1/DRS4
harness port DRS REFCLK0 = sheet DRS1/DRS REFCLK0
harness port I2C_ADCSensor_AVDD = sheet ADC/I2C_ADCSensor_AVDD
harness port I2C_ADCSensor_DVDD = sheet ADC/I2C_ADCSensor_DVDD
harness port I2C_ADCTempSensor = sheet ADC/I2C_ADCTempSensor
harness port I2C_DRS4Sensor = sheet DRS1/I2C_DRS4Sensor
harness port I2C_DRS4Sensor_AVDD = sheet DRS1/I2C_DRS4Sensor_AVDD
harness port I2C_DRS4TempSensor = sheet DRS1/I2C_DRS4TempSensor
harness sheet ADC/OUT = sheet DRS1/OUT

### Notes on the sheet
- 475 Portola Plaza
- GAPS TOF
- igarcia91@g.ucla.edu
- Los Angeles, CA
- 310-825-0344
- Size:
- Date:
- Letter
- Revision:
- Time:
- Sheet
- of
- andrew.peck@cern.ch
- spq@ucla.edu
- File:

## Sheet DRS4.SchDoc: My title
size A3; Organization: University of California; Address1: 475 Portola Plaza; Address2: Los Angeles, CA 90095; DocumentNumber: 21; Revision: R01; SheetNumber: 21; SheetTotal: 35
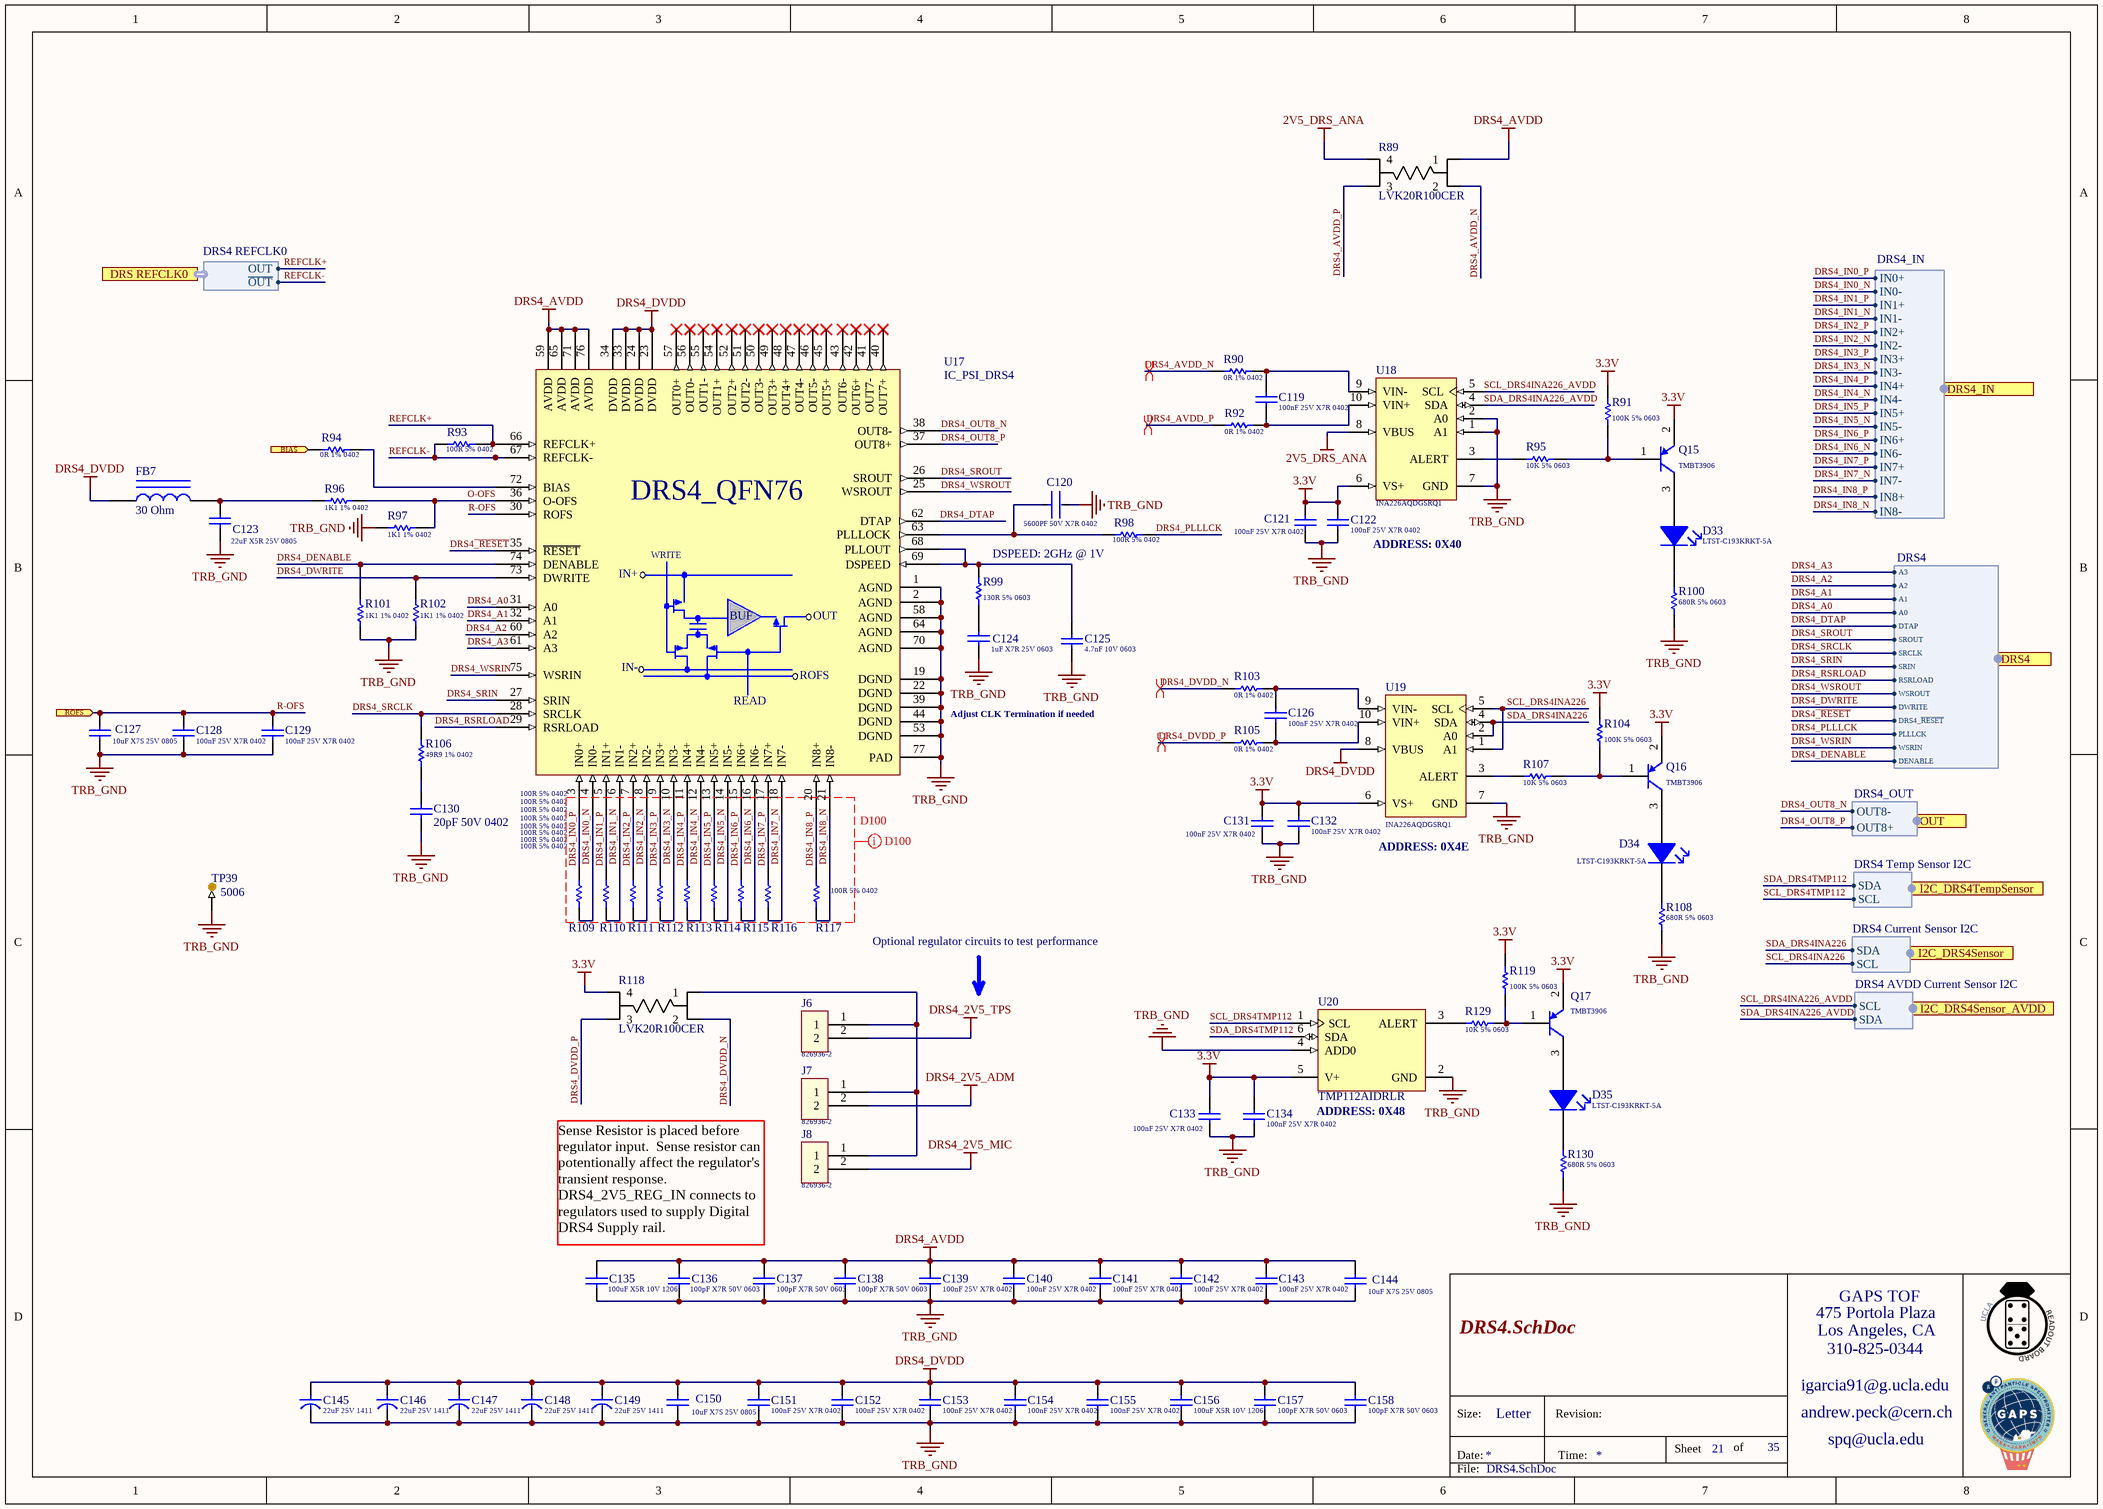
[diagram p2: DRS4.SchDoc]

### Parts
C119  Capacitance: 100nF 25V X7R 0402  [Cap_Taiyo_Yuden_TMK105B7104KV-FR_100nF]  (hidden comment: Cap_Taiyo_Yuden_TMK105B7104KV-FR_100nF)
C120  5600PF 50V X7R 0402  [FP-C0402-BB-MFG]
C121  Capacitance: 100nF 25V X7R 0402  [Cap_Taiyo_Yuden_TMK105B7104KV-FR_100nF]  (hidden comment: Cap_Taiyo_Yuden_TMK105B7104KV-FR_100nF)
C122  Capacitance: 100nF 25V X7R 0402  [Cap_Taiyo_Yuden_TMK105B7104KV-FR_100nF]  (hidden comment: Cap_Taiyo_Yuden_TMK105B7104KV-FR_100nF)
C123  Capacitance: 22uF X5R 25V 0805  [Cap_Murata_GRT21BR61E226ME13L_22uF]  (hidden comment: Cap_Murata_GRT21BR61E226ME13L_22uF)
C124  Capacitance: 1uF X7R 25V 0603  [Cap_Murata_GCJ188R71E105KA01J_1uF]  (hidden comment: Cap_Murata_GCJ188R71E105KA01J_1uF)
C125  4.7nF 10V 0603  [CAPC0603(1608)100_L]
C126  Capacitance: 100nF 25V X7R 0402  [Cap_Taiyo_Yuden_TMK105B7104KV-FR_100nF]  (hidden comment: Cap_Taiyo_Yuden_TMK105B7104KV-FR_100nF)
C127  Capacitance: 10uF X7S 25V 0805  [Cap_Murata_ GRM21BC71E106ME11L_10uF]  (hidden comment: Cap_Murata_ GRM21BC71E106ME11L_10uF)
C128  Capacitance: 100nF 25V X7R 0402  [Cap_Taiyo_Yuden_TMK105B7104KV-FR_100nF]  (hidden comment: Cap_Taiyo_Yuden_TMK105B7104KV-FR_100nF)
C129  Capacitance: 100nF 25V X7R 0402  [Cap_Taiyo_Yuden_TMK105B7104KV-FR_100nF]  (hidden comment: Cap_Taiyo_Yuden_TMK105B7104KV-FR_100nF)
C130  Capacitance: 20pF 50V 0402  [Cap_Murata_GJM1555C1H200GB01D_20pF]  (hidden comment: Cap_Murata_GJM1555C1H200GB01D_20pF)
C131  Capacitance: 100nF 25V X7R 0402  [Cap_Taiyo_Yuden_TMK105B7104KV-FR_100nF]  (hidden comment: Cap_Taiyo_Yuden_TMK105B7104KV-FR_100nF)
C132  Capacitance: 100nF 25V X7R 0402  [Cap_Taiyo_Yuden_TMK105B7104KV-FR_100nF]  (hidden comment: Cap_Taiyo_Yuden_TMK105B7104KV-FR_100nF)
C133  Capacitance: 100nF 25V X7R 0402  [Cap_Taiyo_Yuden_TMK105B7104KV-FR_100nF]  (hidden comment: Cap_Taiyo_Yuden_TMK105B7104KV-FR_100nF)
C134  Capacitance: 100nF 25V X7R 0402  [Cap_Taiyo_Yuden_TMK105B7104KV-FR_100nF]  (hidden comment: Cap_Taiyo_Yuden_TMK105B7104KV-FR_100nF)
C135  Capacitance: 100uF X5R 10V 1206  [Cap_Murata_GRM31CR61A107ME05L_100uF]  (hidden comment: Cap_Murata_GRM31CR61A107ME05L_100uF)
C136  Capacitance: 100pF X7R 50V 0603  [Cap_Kemet_C0603C101J5RACTU_100pF]  (hidden comment: Cap_Kemet_C0603C101J5RACTU_100pF)
C137  Capacitance: 100pF X7R 50V 0603  [Cap_Kemet_C0603C101J5RACTU_100pF]  (hidden comment: Cap_Kemet_C0603C101J5RACTU_100pF)
C138  Capacitance: 100pF X7R 50V 0603  [Cap_Kemet_C0603C101J5RACTU_100pF]  (hidden comment: Cap_Kemet_C0603C101J5RACTU_100pF)
C139  Capacitance: 100nF 25V X7R 0402  [Cap_Taiyo_Yuden_TMK105B7104KV-FR_100nF]  (hidden comment: Cap_Taiyo_Yuden_TMK105B7104KV-FR_100nF)
C140  Capacitance: 100nF 25V X7R 0402  [Cap_Taiyo_Yuden_TMK105B7104KV-FR_100nF]  (hidden comment: Cap_Taiyo_Yuden_TMK105B7104KV-FR_100nF)
C141  Capacitance: 100nF 25V X7R 0402  [Cap_Taiyo_Yuden_TMK105B7104KV-FR_100nF]  (hidden comment: Cap_Taiyo_Yuden_TMK105B7104KV-FR_100nF)
C142  Capacitance: 100nF 25V X7R 0402  [Cap_Taiyo_Yuden_TMK105B7104KV-FR_100nF]  (hidden comment: Cap_Taiyo_Yuden_TMK105B7104KV-FR_100nF)
C143  Capacitance: 100nF 25V X7R 0402  [Cap_Taiyo_Yuden_TMK105B7104KV-FR_100nF]  (hidden comment: Cap_Taiyo_Yuden_TMK105B7104KV-FR_100nF)
C144  Capacitance: 10uF X7S 25V 0805  [Cap_Murata_ GRM21BC71E106ME11L_10uF]  (hidden comment: Cap_Murata_ GRM21BC71E106ME11L_10uF)
C145  Capacitance: 22uF 25V 1411  [Cap_Kemet_T521B226M025ATE100_22uF]  (hidden comment: Cap_Kemet_T521B226M025ATE100_22uF)
C146  Capacitance: 22uF 25V 1411  [Cap_Kemet_T521B226M025ATE100_22uF]  (hidden comment: Cap_Kemet_T521B226M025ATE100_22uF)
C147  Capacitance: 22uF 25V 1411  [Cap_Kemet_T521B226M025ATE100_22uF]  (hidden comment: Cap_Kemet_T521B226M025ATE100_22uF)
C148  Capacitance: 22uF 25V 1411  [Cap_Kemet_T521B226M025ATE100_22uF]  (hidden comment: Cap_Kemet_T521B226M025ATE100_22uF)
C149  Capacitance: 22uF 25V 1411  [Cap_Kemet_T521B226M025ATE100_22uF]  (hidden comment: Cap_Kemet_T521B226M025ATE100_22uF)
C150  Capacitance: 10uF X7S 25V 0805  [Cap_Murata_ GRM21BC71E106ME11L_10uF]  (hidden comment: Cap_Murata_ GRM21BC71E106ME11L_10uF)
C151  Capacitance: 100nF 25V X7R 0402  [Cap_Taiyo_Yuden_TMK105B7104KV-FR_100nF]  (hidden comment: Cap_Taiyo_Yuden_TMK105B7104KV-FR_100nF)
C152  Capacitance: 100nF 25V X7R 0402  [Cap_Taiyo_Yuden_TMK105B7104KV-FR_100nF]  (hidden comment: Cap_Taiyo_Yuden_TMK105B7104KV-FR_100nF)
C153  Capacitance: 100nF 25V X7R 0402  [Cap_Taiyo_Yuden_TMK105B7104KV-FR_100nF]  (hidden comment: Cap_Taiyo_Yuden_TMK105B7104KV-FR_100nF)
C154  Capacitance: 100nF 25V X7R 0402  [Cap_Taiyo_Yuden_TMK105B7104KV-FR_100nF]  (hidden comment: Cap_Taiyo_Yuden_TMK105B7104KV-FR_100nF)
C155  Capacitance: 100nF 25V X7R 0402  [Cap_Taiyo_Yuden_TMK105B7104KV-FR_100nF]  (hidden comment: Cap_Taiyo_Yuden_TMK105B7104KV-FR_100nF)
C156  Capacitance: 100uF X5R 10V 1206  [Cap_Murata_GRM31CR61A107ME05L_100uF]  (hidden comment: Cap_Murata_GRM31CR61A107ME05L_100uF)
C157  Capacitance: 100pF X7R 50V 0603  [Cap_Kemet_C0603C101J5RACTU_100pF]  (hidden comment: Cap_Kemet_C0603C101J5RACTU_100pF)
C158  Capacitance: 100pF X7R 50V 0603  [Cap_Kemet_C0603C101J5RACTU_100pF]  (hidden comment: Cap_Kemet_C0603C101J5RACTU_100pF)
D33  LTST-C193KRKT-5A  [Led_Lite-On_LTST-C193KGKT-5A_Red]
D34  LTST-C193KRKT-5A  [Led_Lite-On_LTST-C193KGKT-5A_Red]
D35  LTST-C193KRKT-5A  [Led_Lite-On_LTST-C193KGKT-5A_Red]
FB7  30 Ohm  [Feb_MURATA_BLM15AX300SZ1D_30]
J6  Series: 826936-2  [Header_TE_Connectivity_826936-2_2POS_5A]  (hidden comment: Header_TE_Connectivity_826936-2_2POS_5A)
J7  Series: 826936-2  [Header_TE_Connectivity_826936-2_2POS_5A]  (hidden comment: Header_TE_Connectivity_826936-2_2POS_5A)
J8  Series: 826936-2  [Header_TE_Connectivity_826936-2_2POS_5A]  (hidden comment: Header_TE_Connectivity_826936-2_2POS_5A)
Q15  Series: TMBT3906  [BJT_PNP_Toshiba_TMBT3906]  (hidden comment: BJT_PNP_Toshiba_TMBT3906)
Q16  Series: TMBT3906  [BJT_PNP_Toshiba_TMBT3906]  (hidden comment: BJT_PNP_Toshiba_TMBT3906)
Q17  Series: TMBT3906  [BJT_PNP_Toshiba_TMBT3906]  (hidden comment: BJT_PNP_Toshiba_TMBT3906)
R89  LVK20R100CER  [OH_LVK20_OHM]
R90  Resistance: 0R 1% 0402  [Res_Vishay_CRCW04020000Z0EDC_0_Ohm]  (hidden comment: Res_Vishay_CRCW04020000Z0EDC_0_Ohm)
R91  100K 5% 0603  [RESC0603(1608)_N]
R92  Resistance: 0R 1% 0402  [Res_Vishay_CRCW04020000Z0EDC_0_Ohm]  (hidden comment: Res_Vishay_CRCW04020000Z0EDC_0_Ohm)
R93  100R 5% 0402  [RESC0402(1005)_L]
R94  Resistance: 0R 1% 0402  [Res_Vishay_CRCW04020000Z0EDC_0_Ohm]  (hidden comment: Res_Vishay_CRCW04020000Z0EDC_0_Ohm)
R95  10K 5% 0603  [RESC0603(1608)_L]
R96  1K1 1% 0402  [RESC0402(1005)_L]
R97  1K1 1% 0402  [RESC0402(1005)_L]
R98  100R 5% 0402  [RESC0402(1005)_L]
R99  130R 5% 0603  [RESC0603(1608)_L]
R100  680R 5% 0603  [RESC0603(1608)_L]
R101  1K1 1% 0402  [RESC0402(1005)_L]
R102  1K1 1% 0402  [RESC0402(1005)_L]
R103  Resistance: 0R 1% 0402  [Res_Vishay_CRCW04020000Z0EDC_0_Ohm]  (hidden comment: Res_Vishay_CRCW04020000Z0EDC_0_Ohm)
R104  100K 5% 0603  [RESC0603(1608)_N]
R105  Resistance: 0R 1% 0402  [Res_Vishay_CRCW04020000Z0EDC_0_Ohm]  (hidden comment: Res_Vishay_CRCW04020000Z0EDC_0_Ohm)
R106  49R9 1% 0402  [RESC0402(1005)_L]
R107  10K 5% 0603  [RESC0603(1608)_L]
R108  680R 5% 0603  [RESC0603(1608)_L]
R109  100R 5% 0402  [RESC0402(1005)_L]
R110  100R 5% 0402  [RESC0402(1005)_L]
R111  100R 5% 0402  [RESC0402(1005)_L]
R112  100R 5% 0402  [RESC0402(1005)_L]
R113  100R 5% 0402  [RESC0402(1005)_L]
R114  100R 5% 0402  [RESC0402(1005)_L]
R115  100R 5% 0402  [RESC0402(1005)_L]
R116  100R 5% 0402  [RESC0402(1005)_L]
R117  100R 5% 0402  [RESC0402(1005)_L]
R118  LVK20R100CER  [OH_LVK20_OHM]
R119  100K 5% 0603  [RESC0603(1608)_N]
R129  10K 5% 0603  [RESC0603(1608)_L]
R130  680R 5% 0603  [RESC0603(1608)_L]
TP39  Series: 5006  [TP_Keystone_Electronics_5006]  (hidden comment: TP_Keystone_Electronics_5006)
U17  IC_PSI_DRS4  [DRS4]
U18  INA226AQDGSRQ1  [INA226AQDGSRQ1]
U19  INA226AQDGSRQ1  [INA226AQDGSRQ1]
U20  TMP112AIDRLR  [TMP112AIDRLR]

### Ports
BIAS (in), DRS4 (harness DRS4), DRS4_IN (harness DRS4_IN), DRS REFCLK0 (harness DRS4 REFCLK0), I2C_DRS4Sensor (harness DRS4 Current Sensor I2C), I2C_DRS4Sensor_AVDD (harness DRS4 AVDD Current Sensor I2C), I2C_DRS4TempSensor (harness DRS4 Temp Sensor I2C), OUT (harness DRS4_OUT), ROFS (in)

### Harnesses
DRS4: A3, A2, A1, A0, DTAP, SROUT, SRCLK, SRIN, RSRLOAD, WSROUT, DWRITE, DRS4_~{RESET}, PLLLCK, WSRIN, DENABLE
DRS4_IN: IN0+, IN0-, IN1+, IN1-, IN2+, IN2-, IN3+, IN3-, IN4+, IN4-, IN5+, IN5-, IN6+, IN6-, IN7+, IN7-, IN8+, IN8-
DRS4_OUT: OUT8+, OUT8-
DRS4 REFCLK0: OUT, ~{OUT}
DRS4 Temp Sensor I2C: SCL, SDA
DRS4 Current Sensor I2C: SCL, SDA
DRS4 AVDD Current Sensor I2C: SCL, SDA

### Nets
2V5_DRS_ANA: R89.4 U18.8(VBUS)
3.3V: C121.2 C122.2 C131.2 C132.2 C133.2 C134.2 Q15.2(E) Q16.2(E) Q17.2(E) R91.2 R104.2 R118.4 R119.2 U18.6(VS+) U19.6(VS+) U20.5(V+)
DRS4_2V5_ADM: J7.2
DRS4_2V5_MIC: J8.2
DRS4_2V5_TPS: J6.2
DRS4_AVDD: C135.2 C136.1 C137.1 C138.1 C139.2 C140.2 C141.2 C142.2 C143.2 C144.1 R89.1 U17.59(AVDD) U17.65(AVDD) U17.71(AVDD) U17.76(AVDD)
DRS4_DVDD: C145.1 C146.1 C147.1 C148.1 C149.1 C150.1 C151.2 C152.2 C153.2 C154.2 C155.2 C156.2 C157.1 C158.1 FB7.1 U17.23(DVDD) U17.24(DVDD) U17.33(DVDD) U17.34(DVDD) U19.8(VBUS)
TRB_GND: C120.2 C121.1 C122.1 C123.1 C124.1 C125.1 C127.2 C128.1 C129.1 C130.1 C131.1 C132.1 C133.1 C134.1 C135.1 C136.2 C137.2 C138.2 C139.1 C140.1 C141.1 C142.1 C143.1 C144.2 C145.2 C146.2 C147.2 C148.2 C149.2 C150.2 C151.1 C152.1 C153.1 C154.1 C155.1 C156.1 C157.2 C158.2 R97.2 R100.1 R101.1 R102.1 R108.1 R130.1 TP39.1 U17.1(AGND) U17.2(AGND) U17.19(DGND) U17.22(DGND) U17.39(DGND) U17.44(DGND) U17.53(DGND) U17.58(AGND) U17.64(AGND) U17.70(AGND) U17.77(PAD) U18.1(A1) U18.2(A0) U18.7(GND) U19.7(GND) U20.2(GND) U20.4(ADD0)
BIAS: R94.1 ; port BIAS
DRS4~{_RESET}: U17.35(~{RESET}) ; port DRS4.DRS4_~{RESET}
DRS4_A0: U17.31(A0) ; port DRS4.A0
DRS4_A1: U17.32(A1) ; port DRS4.A1
DRS4_A2: U17.60(A2) ; port DRS4.A2
DRS4_A3: U17.61(A3) ; port DRS4.A3
DRS4_AVDD_N: R89.2 R90.1
DRS4_AVDD_P: R89.3 R92.1
DRS4_DENABLE: R101.2 U17.74(DENABLE) ; port DRS4.DENABLE
DRS4_DTAP: U17.62(DTAP) ; port DRS4.DTAP
DRS4_DVDD_N: R103.1 R118.2
DRS4_DVDD_P: R105.1 R118.3
DRS4_DWRITE: R102.2 U17.73(DWRITE) ; port DRS4.DWRITE
DRS4_IN0_N: R109.2 U17.4(IN0-) ; port DRS4_IN.IN0-
DRS4_IN0_P: R109.1 U17.3(IN0+) ; port DRS4_IN.IN0+
DRS4_IN1_N: R110.2 U17.6(IN1-) ; port DRS4_IN.IN1-
DRS4_IN1_P: R110.1 U17.5(IN1+) ; port DRS4_IN.IN1+
DRS4_IN2_N: R111.2 U17.8(IN2-) ; port DRS4_IN.IN2-
DRS4_IN2_P: R111.1 U17.7(IN2+) ; port DRS4_IN.IN2+
DRS4_IN3_N: R112.2 U17.10(IN3-) ; port DRS4_IN.IN3-
DRS4_IN3_P: R112.1 U17.9(IN3+) ; port DRS4_IN.IN3+
DRS4_IN4_N: R113.2 U17.12(IN4-) ; port DRS4_IN.IN4-
DRS4_IN4_P: R113.1 U17.11(IN4+) ; port DRS4_IN.IN4+
DRS4_IN5_N: R114.2 U17.14(IN5-) ; port DRS4_IN.IN5-
DRS4_IN5_P: R114.1 U17.13(IN5+) ; port DRS4_IN.IN5+
DRS4_IN6_N: R115.2 U17.16(IN6-) ; port DRS4_IN.IN6-
DRS4_IN6_P: R115.1 U17.15(IN6+) ; port DRS4_IN.IN6+
DRS4_IN7_N: R116.2 U17.18(IN7-) ; port DRS4_IN.IN7-
DRS4_IN7_P: R116.1 U17.17(IN7+) ; port DRS4_IN.IN7+
DRS4_IN8_N: R117.2 U17.21(IN8-) ; port DRS4_IN.IN8-
DRS4_IN8_P: R117.1 U17.20(IN8+) ; port DRS4_IN.IN8+
DRS4_OUT8_N: U17.38(OUT8-) ; port OUT.OUT8-
DRS4_OUT8_P: U17.37(OUT8+) ; port OUT.OUT8+
DRS4_PLLLCK: R98.1 ; port DRS4.PLLLCK
DRS4_RSRLOAD: U17.29(RSRLOAD) ; port DRS4.RSRLOAD
DRS4_SRCLK: R106.1 U17.28(SRCLK) ; port DRS4.SRCLK
DRS4_SRIN: U17.27(SRIN) ; port DRS4.SRIN
DRS4_SROUT: U17.26(SROUT) ; port DRS4.SROUT
DRS4_WSRIN: U17.75(WSRIN) ; port DRS4.WSRIN
DRS4_WSROUT: U17.25(WSROUT) ; port DRS4.WSROUT
O-OFS: R96.1 R97.1 U17.36(O-OFS)
R-OFS: C127.1 C128.2 C129.2 U17.30(ROFS) ; port ROFS
REFCLK+: R93.1 U17.66(REFCLK+) ; port DRS REFCLK0.OUT  [project net OUT2_P]
REFCLK-: R93.2 U17.67(REFCLK-) ; port DRS REFCLK0.~{OUT}  [project net OUT2_N]
SCL_DRS4INA226: U19.1(A1) U19.5(SCL) ; port I2C_DRS4Sensor.SCL
SCL_DRS4INA226_AVDD: U18.5(SCL) ; port I2C_DRS4Sensor_AVDD.SCL
SCL_DRS4TMP112: U20.1(SCL) ; port I2C_DRS4TempSensor.SCL
SDA_DRS4INA226: U19.2(A0) U19.4(SDA) ; port I2C_DRS4Sensor.SDA
SDA_DRS4INA226_AVDD: U18.4(SDA) ; port I2C_DRS4Sensor_AVDD.SDA
SDA_DRS4TMP112: U20.6(SDA) ; port I2C_DRS4TempSensor.SDA
NetC119_1: C119.1 R92.2 U18.10(VIN+)
NetC119_2: C119.2 R90.2 U18.9(VIN-)
NetC120_1: C120.1 R98.2 U17.63(PLLLOCK)
NetC123_2: C123.2 FB7.2 R96.2
NetC124_2: C124.2 R99.1
NetC125_2: C125.2 R99.2 U17.68(PLLOUT) U17.69(DSPEED)
NetC126_1: C126.1 R105.2 U19.10(VIN+)
NetC126_2: C126.2 R103.2 U19.9(VIN-)
NetC130_2: C130.2 R106.2
NetD33_1: D33.1(K) R100.2
NetD33_2: D33.2(A) Q15.3(C)
NetD34_1: D34.1(K) R108.2
NetD34_2: D34.2(A) Q16.3(C)
NetD35_1: D35.1(K) R130.2
NetD35_2: D35.2(A) Q17.3(C)
NetJ6_1: J6.1 J7.1 J8.1 R118.1
NetQ15_1: Q15.1(B) R91.1 R95.1
NetQ16_1: Q16.1(B) R104.1 R107.1
NetQ17_1: Q17.1(B) R119.1 R129.1
NetR94_2: R94.2 U17.72(BIAS)
NetR95_2: R95.2 U18.3(ALERT)
NetR107_2: R107.2 U19.3(ALERT)
NetR129_2: R129.2 U20.3(ALERT)

Not connected (* = marked no-connect by the designer): U17 40(OUT7+)* 41(OUT7-)* 42(OUT6+)* 43(OUT6-)* 45(OUT5+)* 46(OUT5-)* 47(OUT4-)* 48(OUT4+)* 49(OUT3+)* 50(OUT3-)* 51(OUT2-)* 52(OUT2+)* 54(OUT1+)* 55(OUT1-)* 56(OUT0-)* 57(OUT0+)*

### Layout directives
differential pair; differential pair class D100: DRS4_IN0_N, DRS4_IN0_P, DRS4_IN1_N, DRS4_IN1_P, DRS4_IN2_N, DRS4_IN2_P, DRS4_IN3_N, DRS4_IN3_P, DRS4_IN4_N, DRS4_IN4_P, DRS4_IN5_N, DRS4_IN5_P, DRS4_IN6_N, DRS4_IN6_P, DRS4_IN7_N, DRS4_IN7_P, DRS4_IN8_N, DRS4_IN8_P
differential pair: DRS4_AVDD_N, DRS4_AVDD_P, DRS4_DVDD_N, DRS4_DVDD_P

### Notes on the sheet
- DSPEED: 2GHz @ 1V
- ADDRESS: 0X40
- Adjust CLK Termination if needed
- (near U17) D100
- (near U19) ADDRESS: 0X4E
- Optional regulator circuits to test performance
- (near U20) ADDRESS: 0X48
- Sense Resistor is placed before regulator input.  Sense resistor can potentionally affect the regulator's transient response. DRS4_2V5_REG_IN connects to regulators used to supply Digital DRS4 Supply rail.
- 475 Portola Plaza
- GAPS TOF
- igarcia91@g.ucla.edu
- Los Angeles, CA
- 310-825-0344
- Size:
- Date:
- Letter
- Revision:
- Time:
- Sheet
- of
- andrew.peck@cern.ch
- spq@ucla.edu
- File:
- (in symbol DRS4) DRS4_QFN76; WRITE; IN+; BUF; OUT; IN-; READ

### Library data of the parts
C119 C121 C122 C126 C128 C129 C131-C134 C139-C143 C151-C155 = Cap_Taiyo_Yuden_TMK105B7104KV-FR_100nF: CAP CER 100nF 25V X7R 0402; Supplier 1: Mouser; Supplier Part Number 1: 963-TMK105B7104KV-FR
C120 = CMP-03020-007524-1: CAP CER 5600PF 50V X7R 0402 / C0402C562K5RACTU; Manufacturer: Kemet; Temperature Coefficient: 15%; Tolerance: 0.1; Material: Ceramic; Value: 5,600 pF; Temperature Characteristic: X7R; Device Class L3: Ceramic Capacitors; Height: 0.55mm; Temperature: -55°C to +125°C; Package: C0402-BB; Category: Cap; ComponentLink2Description: Datasheet; Device Class L2: Capacitors; Automotive: No; Device Class L1: Passive Components; Lead Free: Yes; ComponentLink2URL: https://content.kemet.com/datasheets/KEM_C1002_X7R_SMD.pdf; Digikey Description: CAP CER 5600PF 50V X7R 0402; Temperature Range High: +125°C; RoHS: TRUE; Octopart: https://octopart.com/c0402c562k5ractu-kemet-98458; Temperature Range Low: -55°C; Ipc Land Pattern Name: CAPC10050X50; Voltage Rating: 50 V; Mouser Description: Multilayer Ceramic Capacitors MLCC - SMD/SMT 50volts 5600pF X7R 10%; Manufacturer Part Number: C0402C562K5RACTU; Capacitance: 5,600 pF
C123 = Cap_Murata_GRT21BR61E226ME13L_22uF: CAP CER 22uF 25V X5R 0805; Supplier 1: Mouser; Supplier Part Number 1: 81-GRT21BR61E226ME3L
C124 = Cap_Murata_GCJ188R71E105KA01J_1uF: CAP CER 1uF 25V X7R 0603; Supplier 1: Mouser; Supplier Part Number 1: 81-GCJ188R71E105KA1J
C125 = CMP-1035-02189-1: CAP 4.7nF 10V ±10% 0603 (1608 Metric) Thickness 1mm SMD; Case-Metric: 1608; Tolerance: Â±10%; Case-EIA: 0603; Max Thickness: 1 mm; Technology: SMT; Rated Voltage: 10 V; Value: 4.7nF
C127 C144 C150 = Cap_Murata_ GRM21BC71E106ME11L_10uF: CAP CER 10uF 25V X7R 0805; Supplier 1: Mouser; Supplier Part Number 1: 81-GRM21BC71E106ME1L
C130 = Cap_Murata_GJM1555C1H200GB01D_20pF: Multilayer Ceramic Capacitors MLCC - SMD/SMT 0402 20pF 50Volts C0G 2%; Supplier 1: Mouser; Supplier Part Number 1: 81-GJM1555C1H200GB01
C135 C156 = Cap_Murata_GRM31CR61A107ME05L_100uF: CAP CER 100uF 25V X5R 1206; Supplier Part Number 1: 81-GRM31CR61A107ME5L; Supplier 1: Mouser
C136-C138 C157 C158 = Cap_Kemet_C0603C101J5RACTU_100pF: CAP CER 100pF 50V X7R 0603; Supplier 1: Mouser; Supplier Part Number 1: 80-C0603C101J5R
C145-C149 = Cap_Kemet_T521B226M025ATE100_22uF: Tantalum Capacitors - Polymer SMD 25V 22uF 1311 20% ESR=100mOhms; Supplier Part Number 1: 80-T521B226M25ATE100; Supplier 1: Mouser
D33-D35 = Led_Lite-On_LTST-C193KGKT-5A_Red: Standard LEDs - SMD Red 470nm 28mcd 20mA; Supplier 1: Mouser; Supplier Part Number 1: 859-LTSTC193KRKT5A; Series: LTST-C193KRKT-5A
FB7 = Feb_MURATA_BLM15AX300SZ1D_30: Feb SMD 30 OHM 25% 3/4W 0402; Supplier 1: Mouser; Supplier Part Number 1: 81-BLM15AX300SZ1D
J6-J8 = Header_TE_Connectivity_826936-2_2POS_5A: Headers & Wire Housings 2P SINGLE ROW 5A; Supplier Part Number 1: 571-826936-2; Supplier 1: Mouser
Q15-Q17 = BJT_PNP_Toshiba_TMBT3906: Bipolar Transistors - BJT Transistor for Low Freq. Amplification; Manufacturer Part Number 1: TMBT3906,LM; Supplier 1: Mouser; Supplier Part Number 1: 757-TMBT3906LM; Manufacturer: Toshiba
R89 R118 = LVK20R100CER: Current Sense Resistors - SMD .1 OHM.25% 3/4W; Vendor: Ohmite; Built_By: EMA_UL_Team; SourceLibrary: Ohmite_2014-12-31; Manufacturer_Part_Number: LVK20R100CER; Copyright: Copyright (C) 2018 Accelerated Designs. All rights reserved; RefDes: RefDes; Type: DEV
R90 R92 R94 R103 R105 = Res_Vishay_CRCW04020000Z0EDC_0_Ohm: 0R 0.062W 1% 0402 (1005 Metric)  SMD; Supplier 1: Mouser; Supplier Part Number 1: 71-CRCW04020000Z0EDC
R91 R104 R119 = CMP-1012-00122-1: 100K 0.1W 5% 0603 (1608 Metric)  SMD; Case-EIA: 0603; Value: 100000.00 Ohm; Case-Metric: 1608; Tolerance: 5 %; Power: 0.1 W; Technology: SMT
R93 R98 R109-R117 = CMP-1011-00050-1: 100R 0.063W 5% 0402 (1005 Metric)  SMD; Case-EIA: 0402; Value: 100.00 Ohm; Case-Metric: 1005; Tolerance: 5 %; Technology: SMT; Power: 0.063 W
R95 R107 R129 = CMP-1012-00098-1: 10K 0.1W 5% 0603 (1608 Metric)  SMD; Case-EIA: 0603; Value: 10000.00 Ohm; Case-Metric: 1608; Technology: SMT; Tolerance: 5 %; Power: 0.1 W
R96 R97 R101 R102 = CMP-1011-00514-1: 1K1 0.063W 1% 0402 (1005 Metric)  SMD; Case-Metric: 1005; Case-EIA: 0402; Value: 1100.00 Ohm; Power: 0.063 W; Tolerance: 1 %; Technology: SMT
R99 = CMP-1012-00053-1: 130R 0.1W 5% 0603 (1608 Metric)  SMD; Case-Metric: 1608; Case-EIA: 0603; Value: 130.00 Ohm; Technology: SMT; Tolerance: 5 %; Power: 0.1 W
R100 R108 R130 = CMP-1012-00070-1: 680R 0.1W 5% 0603 (1608 Metric)  SMD; Case-EIA: 0603; Value: 680.00 Ohm; Case-Metric: 1608; Tolerance: 5 %; Technology: SMT; Power: 0.1 W
R106 = CMP-1011-00363-1: 49R9 0.063W 1% 0402 (1005 Metric)  SMD; Case-EIA: 0402; Case-Metric: 1005; Value: 49.90 Ohm; Power: 0.063 W; Technology: SMT; Tolerance: 1 %
TP39 = TP_Keystone_Electronics_5006: Circuit Board Hardware - PCB TEST POINT BLK .063; Supplier 1: Mouser; Supplier Part Number 1: 534-5006
U17 = DRS4: DRS4 QFN76 DAQ Chip; Series: DRS4
U18 U19 = INA226AQDGSRQ1: Current & Power Monitors & Regulators Automotive, 36-V, Ultra-High Accuracy, Low-/High-Side, I2C Out Current/Power Monitor w/ Alert 10-VSSOP -40 to 125; Supplier 1: Mouser; Supplier Part Number 1: 595-INA226AQDGSRQ1
U20 = TMP112AIDRLR: Board Mount Temperature Sensors Hi-Prec Lo-Pwr Dig Temp Sensor; Supplier 1: Mouser; Supplier Part Number 1: 595-TMP112AIDRLR